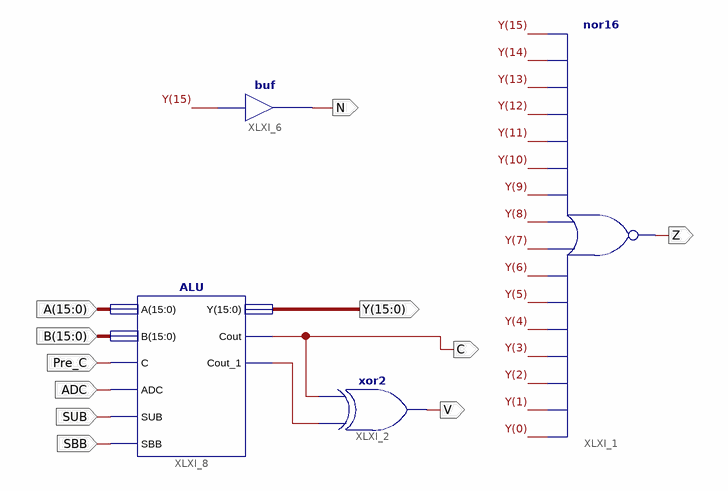
[diagram p0: schematic sheet 1]
// Xilinx ISE schematic ALU_CC.sch (virtex6) as structural Verilog: 4 symbols, 11 ports
module ALU_CC (
  input  [15:0] A,
  input  [15:0] B,
  input  Pre_C,
  input  ADC,
  input  SUB,
  input  SBB,
  output [15:0] Y,
  output Z,
  output V,
  output C,
  output N
);

  wire XLXN_22;

  nor XLXI_1 (Z, Y[0], Y[1], Y[2], Y[3], Y[4], Y[5], Y[6], Y[7], Y[8], Y[9], Y[10], Y[11], Y[12], Y[13], Y[14], Y[15]);
  xor XLXI_2 (V, XLXN_22, C);
  buf XLXI_6 (N, Y[15]);
  ALU XLXI_8 (.A(A), .B(B), .C(Pre_C), .ADC(ADC), .SUB(SUB), .SBB(SBB), .Y(Y), .Cout(C), .Cout_1(XLXN_22));
endmodule
